# EAGLE design MySens-GWeasySensRS485-V01-014 (EAGLE 7.6.0)
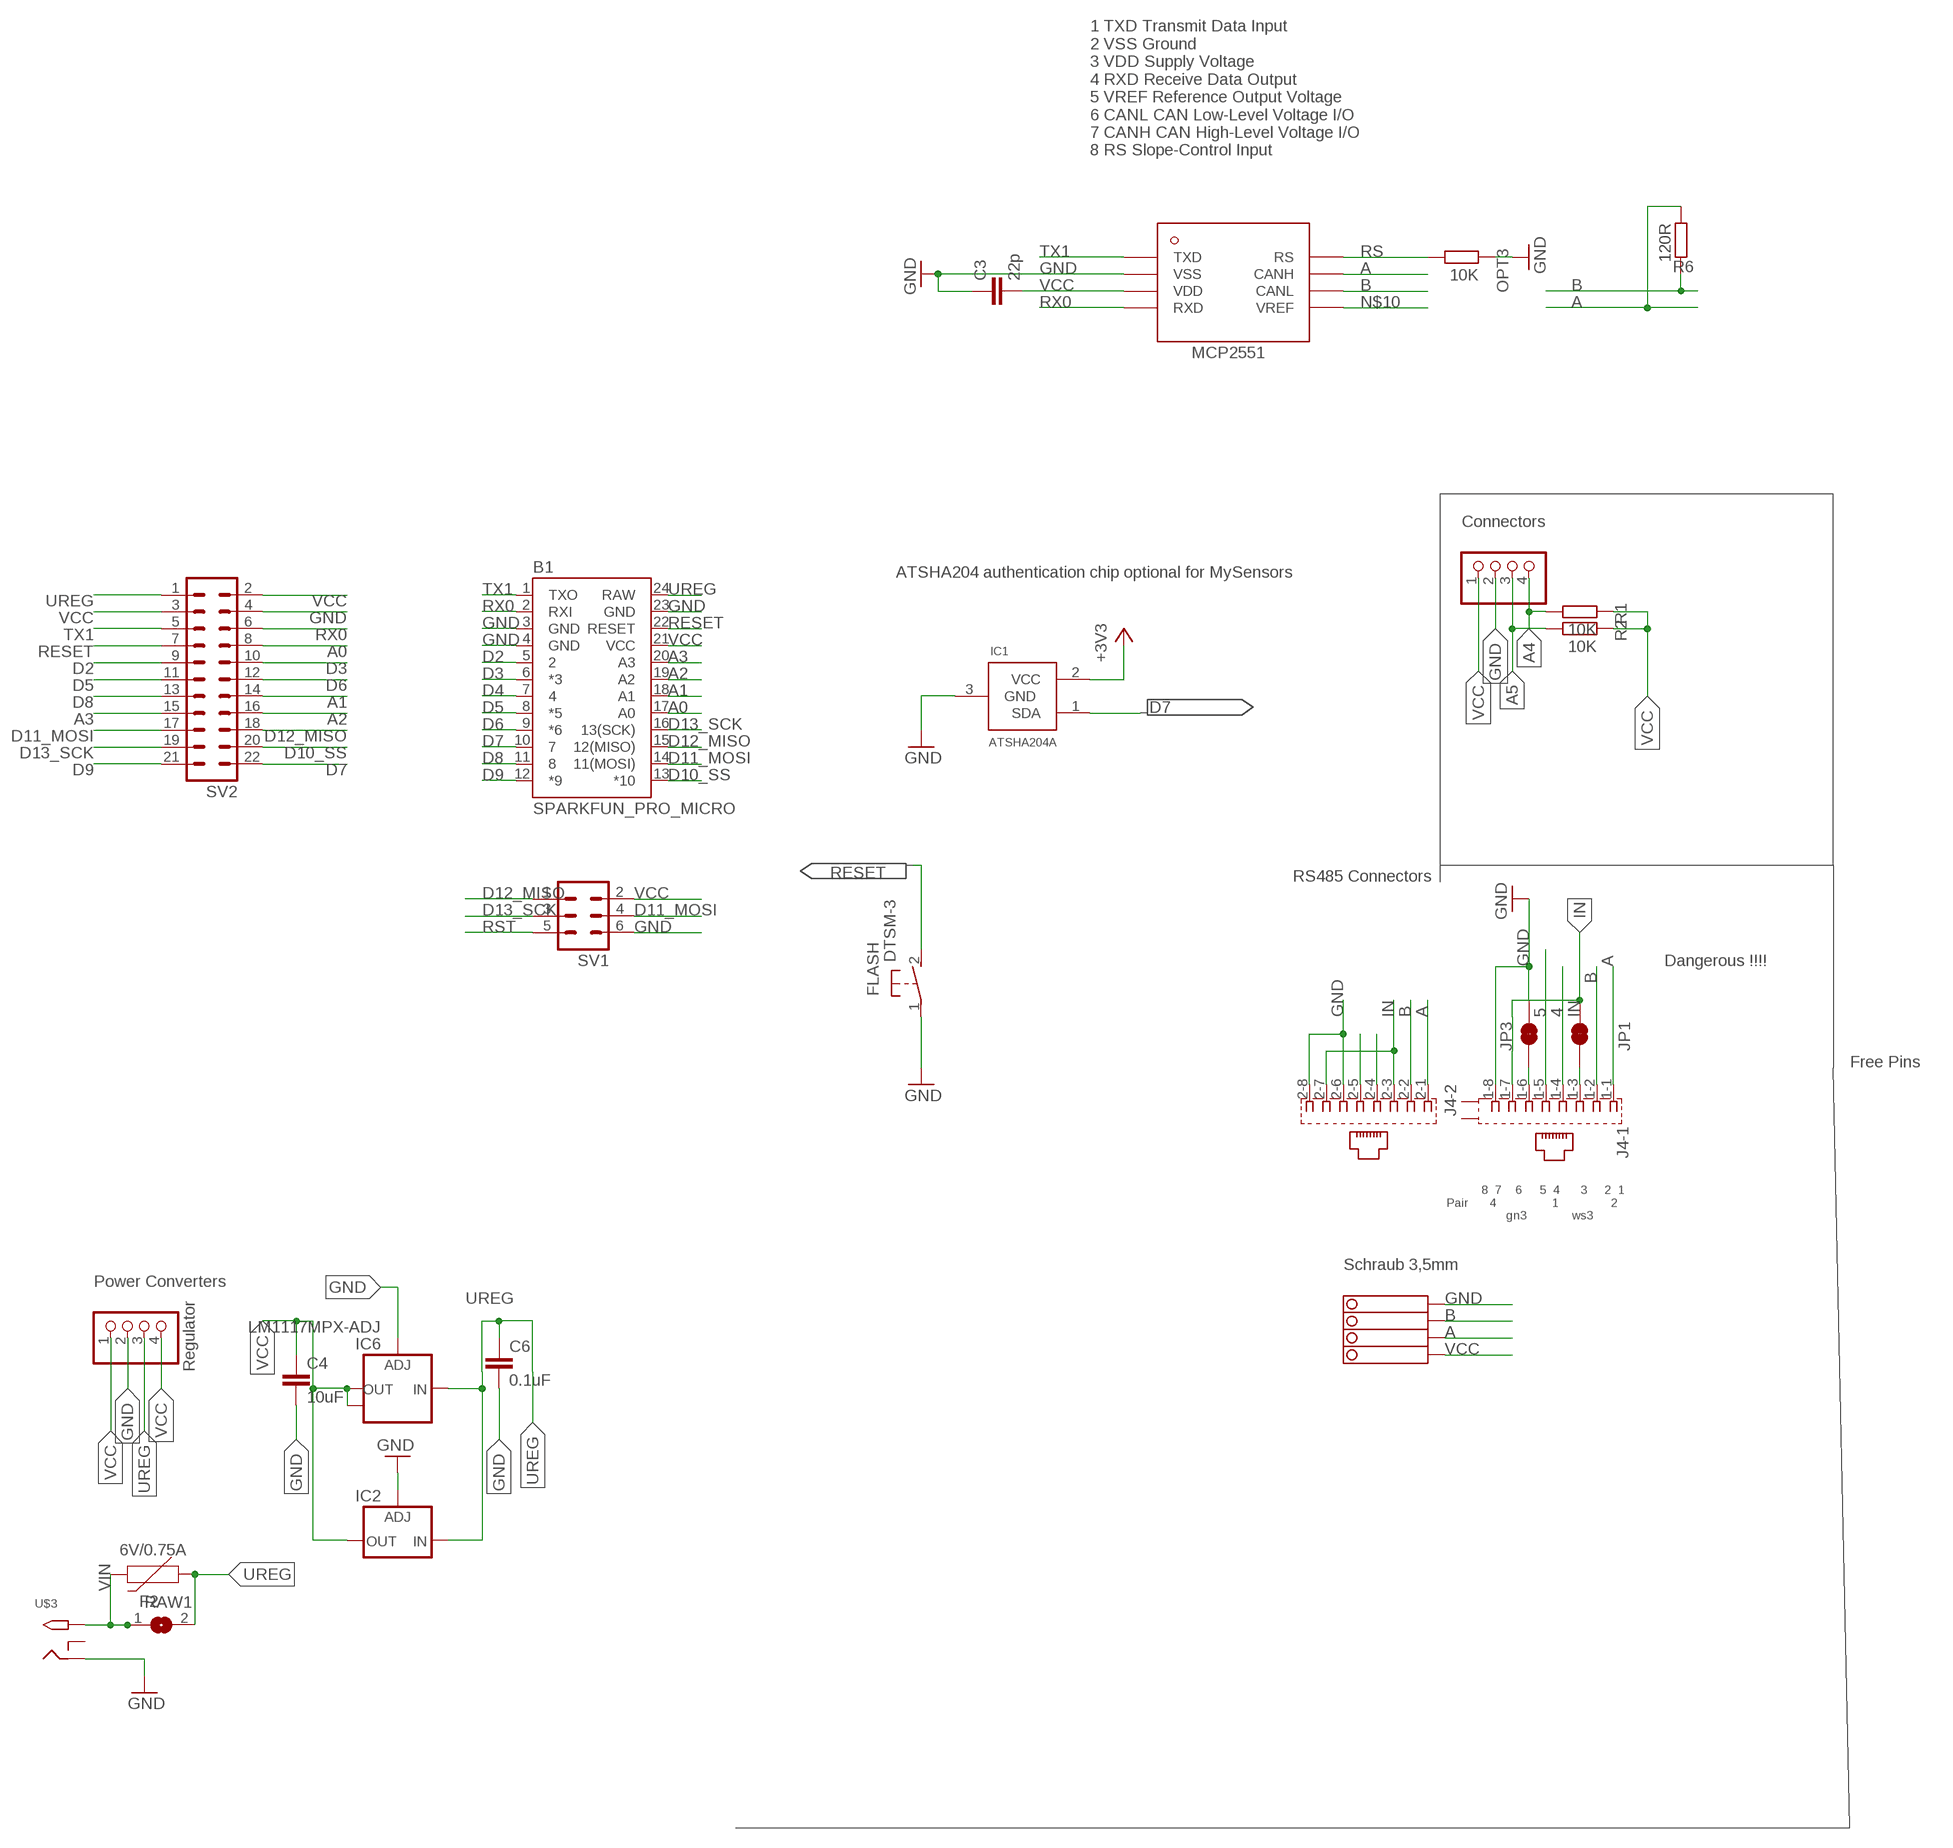
[diagram p0: schematic, sheet 1]

## Parts
B1  SPARKFUN_PRO_MICRO  [SPARKFUN_PRO_MICRO]
C3  22p  C-EUC0805  [C0805]
C4  10uF  C-EUC1210  [C1210]
C6  0.1uF  C-EUC1206  [C1206]
F2  6V/0.75A  PPTC_THREE-QUARTER-AMP  [1206]
FLASH  DTSM-3  [DTSM-3]
IC1  ATSHA204A  [SOT23]
IC2  LD117ADT50TR  [DPACK]
IC6  LM1117MPX-ADJ  [SOT223]
J4  RJ45_2X_NARROW_SHILDPINS_NOCASE  [RJ45_2X_NARROW_SHILDPINS_NOCASE]
JP1  JUMPER-SMT_2_NC_TRACE_SILK  [SMT-JUMPER_2_NC_TRACE_SILK]
JP3  JUMPER-SMT_2_NC_TRACE_SILK  [SMT-JUMPER_2_NC_TRACE_SILK]
JP10  PINHD-1X04_2.54-S  [1X04-S]
OPT3  10K  R-EU_R0805  [R0805]
R1  10K  R-EU_R0805  [R0805]
R2  10K  R-EU_R0805  [R0805]
R6  120R  R-EU_R0805  [R0805]
RAW1  SJ  [SJ]
STEPDWN  PINHD-1X04_2.54-S  [1X04-S]
SV1  MA03-2  [MA03-2]
SV2  MA11-2  [MA11-2]
U$1  MCP2551  [SOIC-8]
U$3  2.1MMJACKTHM  [PJ-102A]
X4  1751264  [1751264]

## Nets
1: J4.1-3 JP1.1
2: J4.1-6 JP3.1
3V3: IC1.2(VCC) ; supply symbol labelled +3V3
4: J4.1-4
5: J4.1-5
A: J4.1-1 J4.2-1 R6.1 U$1.CANH X4.2
A0: B1.17(A0) SV2.8
A1: B1.18(A1) SV2.14
A2: B1.19(A2) SV2.16
A3: B1.20(A3) SV2.15
A4: JP10.4 R1.2
A5: JP10.3 R2.2
B: J4.1-2 J4.2-2 R6.2 U$1.CANL X4.3
D2: B1.5 SV2.9
D3: B1.6(*3) SV2.10
D4: B1.7
D5: B1.8(*5) SV2.11
D6: B1.9(*6) SV2.12
D7: B1.10 IC1.1(SDA) SV2.22
D8: B1.11 SV2.13
D9: B1.12(*9) SV2.21
D10_SS: B1.13(*10) SV2.20
D11_MOSI: B1.14(11(MOSI)) SV1.4 SV2.17
D12_MISO: B1.15(12(MISO)) SV1.1 SV2.18
D13_SCK: B1.16(13(SCK)) SV1.3 SV2.19
GND [Power]: B1.3(GND) B1.4(GND) B1.23(GND) C3.1 C4.2 C6.2 FLASH.1 IC1.3(GND) IC2.1(ADJ) IC6.1(ADJ) J4.1-8 J4.2-6 J4.2-8 JP3.2 JP10.2 OPT3.1 STEPDWN.2 SV1.6 SV2.4 U$1.VSS U$3.RING X4.4
IN [Power]: J4.1-7 J4.2-3 J4.2-7 JP1.2
N$2: J4.2-4
N$3: J4.2-5
N$10: U$1.VREF
RESET: B1.22(RESET) FLASH.2 SV2.7
RS: OPT3.2 U$1.RS
RST: SV1.5
RX0: B1.2(RXI) SV2.6 U$1.RXD
TX1: B1.1(TXO) SV2.5 U$1.TXD
UREG [Power]: B1.24(RAW) C6.1 F2.1 IC2.3(IN) IC6.3(IN) RAW1.2 STEPDWN.3 SV2.1
VCC [Power]: B1.21(VCC) C3.2 C4.1 IC2.4(OUT) IC6.2(OUT) IC6.TAB(OUT1) JP10.1 R1.1 R2.1 STEPDWN.1 STEPDWN.4 SV1.2 SV2.2 SV2.3 U$1.VDD X4.1
VIN [Power]: F2.2 RAW1.1 U$3.TIP
Unconnected: J4.G1(-1:S1) J4.G3(-1:S2) U$3.RING_SW

## Notes on the sheet
- 1 TXD Transmit Data Input 
  2 VSS Ground 
  3 VDD Supply Voltage 
  4 RXD Receive Data Output 
  5 VREF Reference Output Voltage 
  6 CANL CAN Low-Level Voltage I/O 
  7 CANH CAN High-Level Voltage I/O 
  8 RS Slope-Control Input
- Connectors
- ATSHA204 authentication chip optional for MySensors
- RS485 Connectors
- Dangerous !!!!
- Free Pins
- 8  7    6     5  4      3     2  1
  Pair      4                1               2
                   gn3             ws3
- Schraub 3,5mm
- Power Converters
- Regulator

## Library data of the parts
B1 = SparkFun-Boards:SPARKFUN_PRO_MICRO: SparkFun Pro Micro Atmega32U4 compatible footprint. SparkFun Products: 3.3V/8MHz <https://www.sparkfun.com/products/12587> 5V/16MHz <https://www.sparkfun.com/products/12640>
C3 C4 C6 = rcl:C-EU: CAPACITOR, European symbol
F2 = SparkFun-Fuses:PPTC: Resettable Fuse PPTC Resettable Fuse. Really a sort of resistor with a polymeric positive temperature coefficient whose resistance increases dramatically with an increase in temperature. When heated by the power passing through the resistance rises causing the current to be limited, protecting the circuit. This is achieved by the transition of the polymer from a crystalline to an amorphous state where the conductive carbon separates breaking the conductive pathways found in the cool crystalline structure. When a PPTC cools back down it resumes conducting letting the circuit turn back on. SparkFun Products: SparkFun RedBoard - Programmed with Arduino <https://www.sparkfun.com/products/12757> Pro Micro - 5V/16MHz <https://www.sparkfun.com/products/12640> Arduino Pro 328 - 5V/16MHz <https://www.sparkfun.com/products/10915> MP3 Trigger <https://www.sparkfun.com/products/13720>; PROD_ID: RES-11150
FLASH = mechanics:DTSM-3: Diptronics SMD button 6x3.5 mm
IC1 = Sensor:ATSHA204A
IC2 = v-reg:LD117A?*: Low drop fixed and adjustable positive voltage regulators 1 A Source: http://www.st.com/stonline/products/literature/ds/7194/ld1117axx.pdf
IC6 = lm1117:LM1117MPX-ADJ
J4 = RJ45:RJ45_2X_NARROW_SHILDPINS_NOCASE: RJ45 connector
JP1 JP3 = SparkFun-Jumpers:JUMPER-SMT_2_NC_TRACE: Normally closed trace jumper This jumper has a trace between two pads so it's normally closed (NC). Use a razor knife to open the connection. For best results follow the IPC guidelines for cutting traces: Cutout at least 0.063 mm (0.005 in). Remove all loose material to clean up the cut area. Seal the cut with an approved epoxy. Reapply solder to reclose the connection.
JP10 STEPDWN = pinhead-2:PINHD-1X04: PIN HEADER
OPT3 R1 R2 R6 = rcl:R-EU_: RESISTOR, European symbol
RAW1 = jumper:SJ: SMD solder JUMPER
SV1 = con-lstb:MA03-2: PIN HEADER; OC_FARNELL: unknown; OC_NEWARK: unknown
SV2 = con-Pinheader:MA11-2: PIN HEADER; OC_FARNELL: unknown; OC_NEWARK: unknown
U$1 = MCP2551:MCP2551: The MCP2551 is a high-speed CAN, fault-tolerant device that serves as the interface between a CAN protocol controller and the physical bus. The MCP2551 provides differential transmit and receive capability for the CAN protocol controller and is fully compatible with the ISO-11898 standard, including 24V requirements. It will operate at speeds of up to 1 Mb/s. Typically, each node in a CAN system must have a device to convert the digital signals generated by a CAN controller to signals suitable for transmission over the bus cabling (differential output). It also provides a buffer between the CAN controller and the high-voltage spikes that can be generated on the CAN bus by outside sources (EMI, ESD, electrical transients, etc.).
U$3 = adafruit:2.1MMJACK: 2.1mm x 5.5mm THM DC jack with internal switch. Digikey part #PJ-102A, 4UCON part #05537 2.1mm x 5.5mm SMT DC jack with internal switch. Digikey part #PJ-002A-SMT, 4UCON part #03267 By microbuilder.eu & adafruit.com
X4 = con-phoenix-350:1751264: MKDS 1/ 4-3,5 Printklemme Nennstrom: 10 A Bemessungsspannung: 160 V Raster: 3,5 mm Polzahl: 4 Montageart: Löten Anschlussart: Schraubanschluss Anschlussrichtung vom Leiter zur Platine: 0° Source: http://eshop.phoenixcontact.com .. 1751264.pdf; MPN: 1751264; OC_FARNELL: unknown; OC_NEWARK: 10R0934

## Net classes
0 default: width 0.254 mm
1 Power: width 0.508 mm

## Board
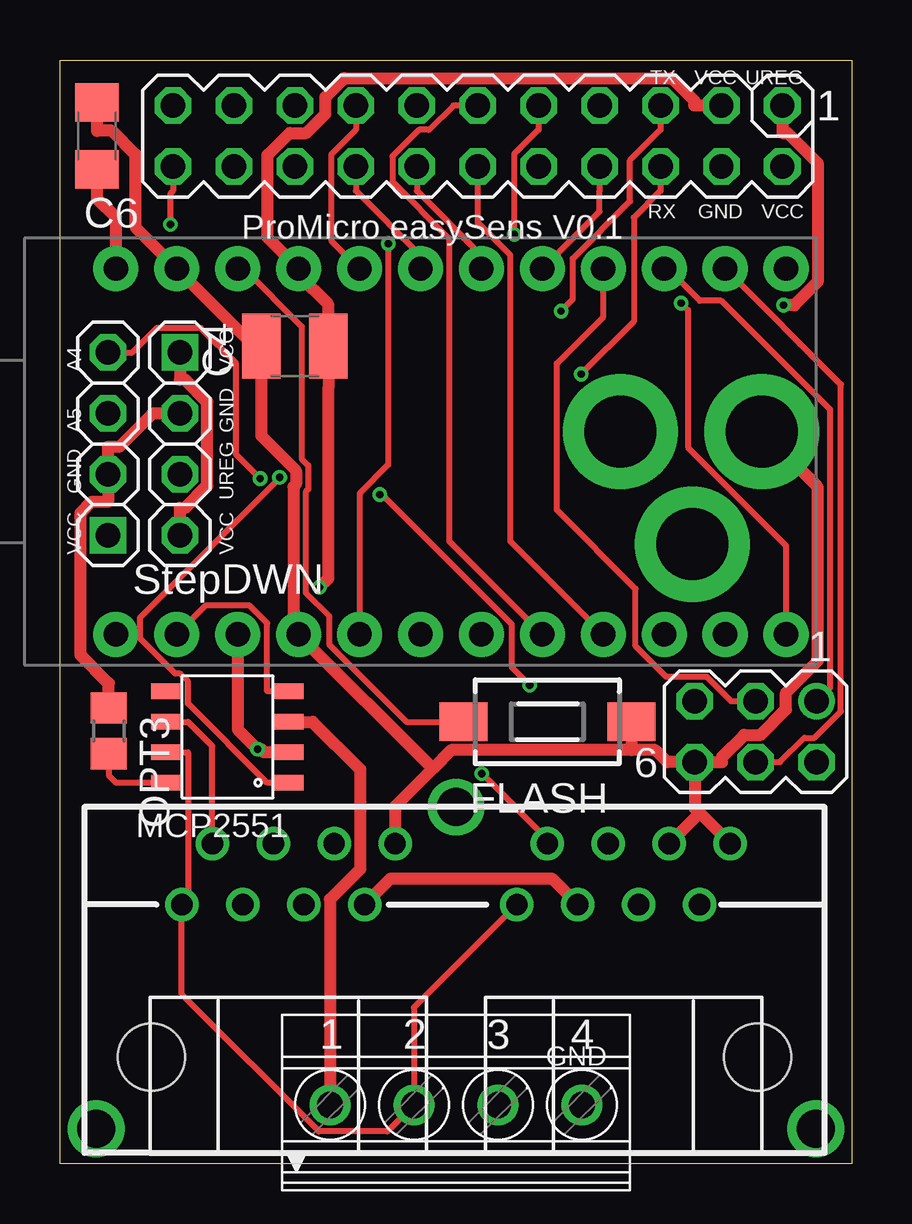
[diagram p1: board, top side]
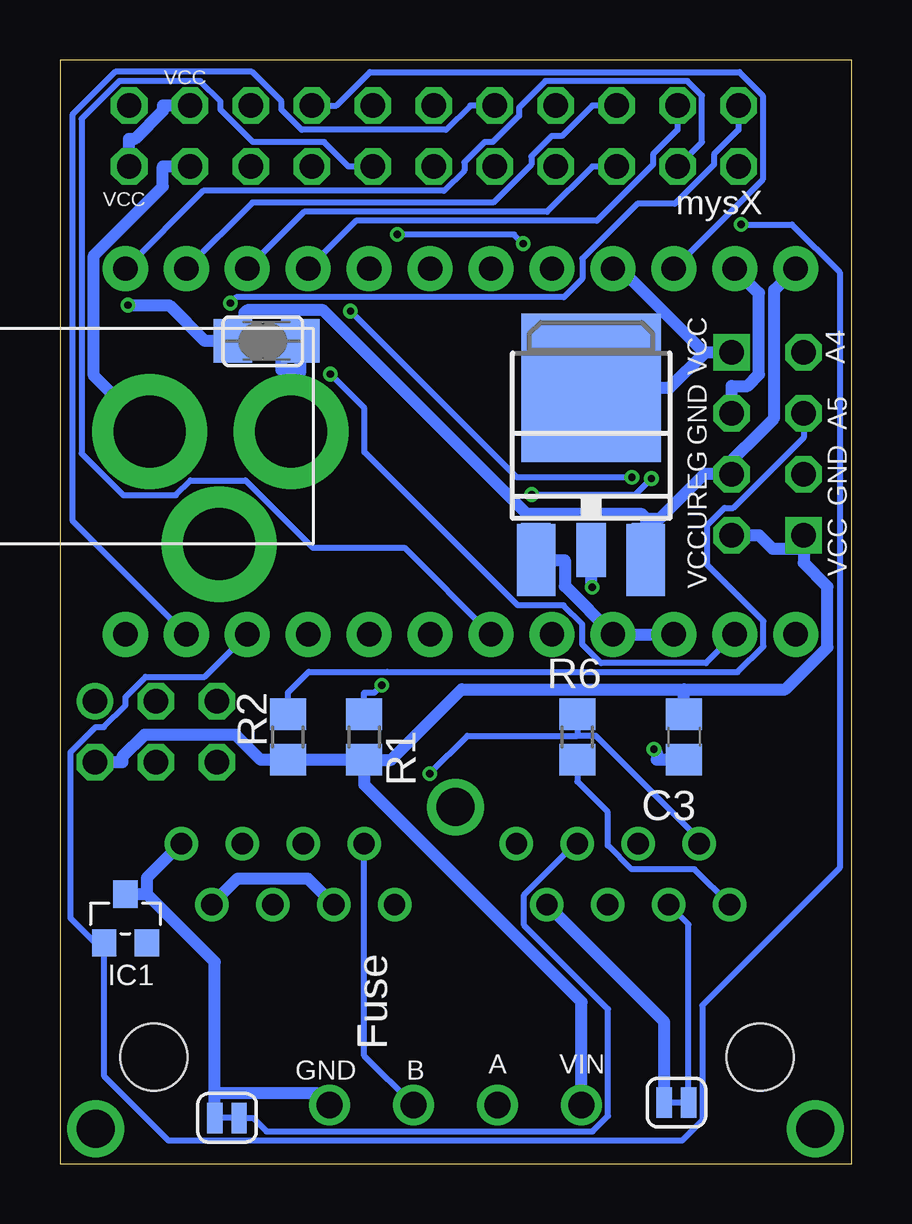
[diagram p2: board, bottom side, seen from below]

Size 33 x 46 mm. Coordinates in mm from the lower left corner, seen from the top.
Outline: 0,0 0,46 33,46 33,0 0,0
Copper layers (1*16): Top 0.035mm / dielectric 1.5mm / Bottom 0.035mm
Design rules "dirt_cheap_dirty_boards.v1": minimum track width 5mil, minimum drill 12mil, track to track 5mil, track to pad 5mil, pad to pad 5mil, via to via 5mil, smd to smd 0mil, copper to edge 10mil, drill to drill 10mil, minimum pad ring 10mil, minimum via ring 6mil, stop-mask expansion 2mil, vias tented up to drill 25mil, thermal gap 10mil

### Footprints (pad centres in the part's own frame; a part is rotated, then mirrored left to right if it is on the bottom)
SPARKFUN_PRO_MICRO = drill 1.016 pad 1.88: 1 -7.62,12.7; 2 -7.62,10.16; 3 -7.62,7.62; 4 -7.62,5.08; 5 -7.62,2.54; 6 -7.62,0; 7 -7.62,-2.54; 8 -7.62,-5.08; 9 -7.62,-7.62; 10 -7.62,-10.16; 11 -7.62,-12.7; 12 -7.62,-15.24; 13 7.62,-15.24; 14 7.62,-12.7; 15 7.62,-10.16; 16 7.62,-7.62; 17 7.62,-5.08; 18 7.62,-2.54; 19 7.62,0; 20 7.62,2.54; 21 7.62,5.08; 22 7.62,7.62; 23 7.62,10.16; 24 7.62,12.7
C0805 = smd 1.3 x 1.5: 1 -0.95,0; 2 0.95,0
C1210 = smd 1.6 x 2.7: 1 -1.4,0; 2 1.4,0
C1206 = smd 1.6 x 1.8: 1 -1.4,0; 2 1.4,0
1206 = smd 1.6 x 1.8: 1 -1.4,0; 2 1.4,0
DTSM-3 = smd 2 x 1.6: 1 -3.494,0; 2 3.494,0
SOT23 = smd 1.016 x 1.143: 1 -0.889,-1.016; 2 0.889,-1.016; 3 0,1.016
DPACK = smd 1.6 x 3: 1 -2.28,-4.8; 3 2.28,-4.8 | smd 5.8 x 6.2: 4 0,2.38
SOT223 = smd 1.219 x 2.235: 1 -2.311,-3.099; 2 0,-3.099; 3 2.311,-3.099 | smd 3.6 x 2.2: TAB 0,3.099
RJ45_2X_NARROW_SHILDPINS_NOCASE = drill 0.889: 1-1 -11.43,6.35; 1-2 -10.16,8.89; 1-3 -8.89,6.35; 1-4 -7.62,8.89; 1-5 -6.35,6.35; 1-6 -5.08,8.89; 1-7 -3.81,6.35; 1-8 -2.54,8.89; 2-1 2.54,6.35; 2-2 3.81,8.89; 2-3 5.08,6.35; 2-4 6.35,8.89; 2-5 7.62,6.35; 2-6 8.89,8.89; 2-7 10.16,6.35; 2-8 11.43,8.89 | drill 1.575 pad 2.184: G1 -15,-3; G2 0,10.414; G3 15,-3 | hole 2.8: -12.7,0; 12.573,0
SMT-JUMPER_2_NC_TRACE_SILK = smd 0.635 x 1.27: 1 -0.508,0; 2 0.508,0
1X04-S = drill 1.016 square: 1 -3.81,0 | drill 1.016 octagon: 2 -1.27,0; 3 1.27,0; 4 3.81,0
R0805 = smd 1.3 x 1.5: 1 -0.95,0; 2 0.95,0
SJ = smd 1.168 x 1.6: 1 -0.762,0; 2 0.762,0
MA03-2 = drill 1.016: 1 -2.54,-1.27 | drill 1.016 octagon: 2 -2.54,1.27; 3 0,-1.27; 4 0,1.27; 5 2.54,-1.27; 6 2.54,1.27
MA11-2 = drill 1.016 octagon: 1 -12.7,-1.27; 2 -12.7,1.27; 3 -10.16,-1.27; 4 -10.16,1.27; 5 -7.62,-1.27; 6 -7.62,1.27; 7 -5.08,-1.27; 8 -5.08,1.27; 9 -2.54,-1.27; 10 -2.54,1.27; 11 0,-1.27; 12 0,1.27; 13 2.54,-1.27; 14 2.54,1.27; 15 5.08,-1.27; 16 5.08,1.27; 17 7.62,-1.27; 18 7.62,1.27; 19 10.16,-1.27; 20 10.16,1.27; 21 12.7,-1.27; 22 12.7,1.27
SOIC-8 = smd 1.27 x 0.635: CANH 2.54,0.635; CANL 2.54,-0.635; RS 2.54,1.905; RXD -2.54,-1.905; TXD -2.54,1.905; VDD -2.54,-0.635; VREF 2.54,-1.905; VSS -2.54,0.635
PJ-102A = drill 3 pad 4.8: RING 0.1,-3.39; RING_SW -4.6,-6.29; TIP 0.1,-9.29
1751264 = drill 1.1 pad 1.7: 1 -5.25,-0.1; 2 -1.75,-0.1; 3 1.75,-0.1; 4 5.25,-0.1

### Placement (x,y rotation side)
B1  15.03,29.68 90 top
C3  6.99,17.78 90 bottom
C4  9.79,34.07 180 top
C6  1.54,42.83 90 top
F2  24.38,34.29 0 bottom
FLASH  20.32,18.41 180 top
IC1  30.27,10.21 0 bottom
IC2  10.86,29.96 0 bottom
IC6  10.86,28.67 0 bottom
J4  16.51,4.45 0 top
JP1  7.3,2.54 180 bottom
JP3  26.04,1.91 180 bottom
JP10  2,30 90 top
OPT3  2.03,18.03 270 top
R1  20.32,17.78 90 bottom
R2  23.5,17.78 90 bottom
R6  11.43,17.78 90 bottom
RAW1  24.54,34.27 180 bottom
STEPDWN  5,30 270 top
SV1  29,18 180 top
SV2  17.41,42.83 180 top
U$1  6.99,17.78 180 top
U$3  32.66,30.42 90 bottom
X4  16.51,2.54 0 top

### Tracks (layer width: path | path; a pad name or v marks a point on that pad's centre or on a via)
1
  Bottom 0.254: JP1.1 6.79,9.97 J4.1-3
2
  Bottom 0.254: JP3.1 24.95,1.91 24.39,1.33 10.8,1.33 10.15,1.98 10.15,6.43 13.65,9.94 13.65,11.19 11.51,13.34 J4.1-6
A
  Top 0.254: U$1.CANH 5.33,17.14 5.33,11.05 J4.1-1 5.08,7.05 10.8,1.33 13.65,1.33 X4.2 14.76,6.5 J4.2-1
  Bottom 0.254: R6.1 11.43,15.93 10.16,14.66 10.16,13.26 9.17,12.26 6.55,12.26 J4.1-1
A0
  Top 0.254: B1.17 22.5,39.69 22.5,40.54 SV2.8
A1
  Top 0.254: SV2.14 14.88,40.54 17.57,37.85 B1.18
A2
  Top 0.254: SV2.16 12.34,40.54 15.03,37.85 B1.19
A3
  Top 0.254: SV2.15 12.34,43.08 11.31,42.06 11.31,38.48 B1.20
A4  (via drill 0.3 pad 0.61)
  Top 0.254: JP10.4 3.02,33.81 4.03,34.83 5.87,34.83 7.34,33.36 7.34,29.55 v8.34,28.55 | v19.58,19.94 18.84,20.68 18.84,22.48 13.44,27.88 v13.33,27.88 | v13.33,27.88
  Bottom 0.254: R1.2 20.32,19.63 19.89,19.63 v19.58,19.94 | v13.33,27.88 9.01,27.88 v8.34,28.55
A5
  Bottom 0.254: JP10.3 2,30.25 4.93,27.32 5.3,27.32 6.02,26.61 6.02,24.95 3.68,22.61 3.68,21.56 4.75,20.48 19.34,20.48 19.35,20.5 22.63,20.5 23.5,19.63 R2.2
B  (via drill 0.3 pad 0.61)
  Top 0.254: J4.2-2 20.32,13.52 v17.59,16.25 | U$1.CANL 5.33,18.41 6.35,17.4 J4.1-2
  Bottom 0.254: v17.59,16.25 16.01,17.83 11.43,17.83 | X4.3 20.32,4.5 J4.2-2 | R6.2 11.43,17.83 | J4.1-2 6.35,13.51 10.66,17.83 11.43,17.83
D2  (via drill 0.3 pad 0.61)
  Top 0.254: v18.94,38.73 18.94,42.07 19.95,43.08 SV2.9 | v13.68,38.34 13.68,29.13 12.49,27.93 B1.5
  Bottom 0.254: v13.68,38.34 14.07,38.73 v18.94,38.73
D3
  Bottom 0.254: B1.6 18.64,25.67 22.46,25.67 25.27,28.47 27.56,28.47 28.17,27.86 30.36,27.86 32.1,29.59 32.1,43.55 30.53,45.12 27.15,45.12 26.3,44.27 26.3,43.93 24.95,42.58 21.99,42.58 20.97,41.56 SV2.10
D5
  Top 0.254: SV2.11 16.4,44.1 15.38,43.08 14.96,43.08 13.86,41.98 13.86,40.92 16.23,38.56 16.23,25.94 B1.8
D6
  Top 0.254: B1.9 18.77,25.94 18.77,37.88 17.41,39.24 17.41,40.54 SV2.12
D7  (via drill 0.3 pad 0.61)
  Top 0.254: SV2.22 4.71,40.54 4.6,40.43 v4.6,39.14
  Bottom 0.254: v4.6,39.14 2.48,39.14 0.49,37.15 0.49,12.32 6.22,6.59 6.22,1.8 7.06,0.95 28.47,0.95 31.15,3.63 IC1.1 31.54,9.2 32.56,10.22 32.56,17.15 31.52,18.19 31.17,18.19 30.27,19.09 30.27,19.45 29.43,20.29 26.96,20.29 B1.10
D8
  Bottom 0.254: SV2.13 15.89,44.1 16.91,43.08 22.92,43.08 23.77,43.93 23.77,44.27 25,45.5 30.69,45.5 32.48,43.71 32.48,26.81 B1.11
D9  (via drill 0.3 pad 0.61)
  Top 0.254: v25.9,35.86 26.18,35.58 26.18,29.85 30.27,25.76 B1.12
  Bottom 0.254: v25.9,35.86 25.65,36.11 11.99,36.11 11.22,36.88 11.22,37.72 8.93,40.01 7.37,40.01 5.73,41.65 5.73,42.07 4.71,43.08 SV2.21
D10_SS
  Bottom 0.254: SV2.20 6.24,42.58 6.24,44.52 6.83,45.12 12.76,45.12 13.86,44.02 13.86,43.68 14.96,42.58 15.3,42.58 16.14,41.73 16.14,41.39 16.99,40.54 27.03,40.54 B1.13
D11_MOSI
  Top 0.254: SV1.4 30.02,16.73 31.03,17.75 31.45,17.75 32.56,18.85 32.56,32.47 B1.14
  Bottom 0.254: B1.14 24.98,40.05 14.94,40.05 13.35,41.64 13.35,41.98 12.51,42.83 12.08,42.83 10.81,44.1 SV2.17
D12_MISO
  Top 0.254: SV1.1 32.11,19.84 32.11,31.43 27.57,35.97 26.68,35.97 25.34,37.3 B1.15
  Bottom 0.254: B1.15 22.82,39.67 12.7,39.67 10.81,41.56 SV2.18
D13_SCK
  Top 0.254: SV1.3 27.98,19.27 26.97,20.29 25.28,20.29 24,21.57 24,23.95 20.71,27.24 20.71,33.35 22.65,35.29 B1.16
  Bottom 0.254: B1.16 20.66,39.29 10.62,39.29 8.27,41.64 8.27,42.07 7.25,43.08 SV2.19
GND  (via drill 0.3 pad 0.61)
  Top 0.508: 15.54,16.47 13.97,14.89 J4.1-8 | 15.54,16.47 B1.4 9.74,22.27 9.74,28.21 9.84,28.32 9.84,28.89 8.39,30.34 8.39,32.34 C4.2 8.1,34.07 B1.23 3.16,39.01 3.16,42.06 2.17,43.05 1.54,43.05 C6.2 | 23.81,17.23 16.31,17.23 15.54,16.47 | 23.81,17.23 24.81,17.23 25.32,16.73 SV1.6 | STEPDWN.2 3.86,31.27 2.46,29.87 2,29.87 JP10.2 2,27.59 1.33,27.59 0.86,27.12 0.86,21.19 2.03,20.02 OPT3.1 | SV1.6 27.6,16.73 27.6,16.95 28.52,17.87 29.22,17.87 30.27,18.92 30.27,19.62 31.59,20.94 31.59,28.19 U$3.RING | FLASH.1 23.81,17.23 | B1.3 7.41,18.1 v8.24,17.27 8.39,17.27 8.51,17.14 U$1.VSS | 26.67,14.61 J4.2-8 | SV1.6 26.46,14.81 26.67,14.61 | 26.67,14.61 J4.2-6
  Bottom 0.508: 26.54,2.92 26.54,8.4 29.38,11.23 | X4.4 22.24,2.92 26.54,2.92 | B1.3 B1.4 11.96,24.07 11.96,25.16 IC2.1 13.14,25.54 IC6.1 | C3.1 8.12,16.83 8.12,17.14 v8.24,17.27 | IC1.3 29.38,11.23 | J4.2-8 29.38,11.9 29.38,11.23 | STEPDWN.2 5,32.41 4.33,32.41 3.86,32.89 3.86,36.29 B1.23 | SV2.4 28.72,41.56 28.72,40.73 31.59,37.85 31.59,32.84 U$3.RING | JP3.2 26.54,2.92
IN
  Top 0.508: J4.1-7 13.78,11.88 20.51,11.88 J4.2-3
  Bottom 0.508: JP1.2 7.81,5.9 J4.1-7 | J4.2-7 25.58,11.88 22.68,11.88 J4.2-3
RESET
  Top 0.254: B1.22 7.67,37.3 10.08,34.89 10.08,29.37 10.35,29.09 10.35,28.11 10.25,28 10.25,23.79 11.22,22.82 11.22,21.64 14.45,18.41 FLASH.2
  Bottom 0.254: SV2.7 21.48,44.1 20.08,45.5 4.68,45.5 3.7,44.52 3.7,41.01 B1.22
RS
  Top 0.254: OPT3.2 2.03,16.18 2.34,15.88 U$1.RS
RX0  (via drill 0.3 pad 0.61)
  Top 0.254: v21.73,32.91 23.92,35.1 23.92,39.43 25.04,40.54 SV2.6 | U$1.RXD 8.64,19.68 8.64,22.52 7.91,23.25 6.06,23.25 B1.2
  Bottom 0.254: B1.2 6.07,20.86 10.44,20.86 11.22,21.64 11.22,22.48 12,23.26 13.91,23.26 20.3,29.66 20.3,31.48 v21.73,32.91
TX1  (via drill 0.3 pad 0.61)
  Top 0.254: 3.34,22.06 3.34,22.76 9.16,28.57 v9.16,28.6 | v20.89,35.53 21.38,36.02 21.38,37.72 23.77,40.1 23.77,41.81 25.04,43.08 SV2.5 | 3.34,22.06 3.34,21.9 4.81,20.43 5.01,20.43 5.33,20.11 5.33,19.18 8.64,15.88 U$1.TXD | 3.34,22.06 B1.1
  Bottom 0.254: v9.16,28.6 13.96,28.6 v20.89,35.53
UREG  (via drill 0.3 pad 0.61)
  Top 0.508: SV2.1 30.11,42.96 30.34,42.96 31.59,41.7 31.59,36.75 30.62,35.78 v30.16,35.78 | C6.1 1.54,40.25 2.33,39.46 B1.24
  Bottom 0.508: 5.57,28.73 3.22,31.08 3.22,36.41 B1.24 | 5.57,28.73 6.14,28.73 7.99,26.88 8.55,26.88 | STEPDWN.3 5.57,28.73 | 8.55,26.88 8.73,27.07 13.52,27.07 22.02,35.57 25.19,35.57 25.3,35.45 RAW1.2 25.32,34.29 F2.1 26.96,34.29 28.46,35.78 v30.16,35.78 | 8.55,26.88 8.55,26.83 IC6.3 8.58,25.54 IC2.3
VCC  (via drill 0.3 pad 0.61)
  Top 0.508: SV2.3 26.43,44.1 26.43,44.32 25.51,45.25 11.86,45.25 11.06,44.45 11.06,43.75 10.27,42.96 9.57,42.96 8.65,42.04 8.65,38.6 B1.21 9.95,37.04 11.19,35.8 C4.1 11.19,32.34 11.19,24.4 v10.81,24.02 | X4.1 11.26,11.02 12.52,12.27 12.52,16.44 10.54,18.41 U$1.VDD | STEPDWN.1 5,32.67 5.22,32.67 6.14,31.75 6.14,28.25 5.22,27.33 5,27.33 STEPDWN.4
  Bottom 0.508: SV2.2 30.11,42.7 29.89,42.7 28.72,43.88 28.72,44.1 SV2.3 | STEPDWN.4 3.86,26.19 3.29,25.62 2,25.62 | 2,25.62 2,25.05 1,24.05 1,21.52 2.76,19.76 6.99,19.76 | JP10.1 2,25.62 | 6.99,19.76 16.26,19.76 19.19,16.83 R1.1 | X4.1 11.26,6.74 20.32,15.8 R1.1 | B1.21 9.63,37.3 6.14,33.81 | STEPDWN.1 6.14,33.81 | 6.14,33.81 6.14,33.77 7.58,32.34 IC2.4 10.29,31.77 IC6.TAB | SV1.2 30.4,16.73 30.4,16.95 29.48,17.87 25.67,17.87 24.63,16.83 R2.1 R1.1 | C3.2 6.99,19.76 | v10.81,24.02 10.86,24.07 IC6.2
VIN
  Bottom 0.508: RAW1.1 23.78,33.09 23.45,33.09 23.36,33.01 | 23.36,33.01 22.98,33.01 F2.2 | U$3.TIP 23.36,33.01

### Text on the board
tNames: TX | VCC | UREG | ProMicro easySens V0.1 | RX | GND | VCC | C6 | A4 | VCC | A5 | GND | GND | UREG | VCC | VCC | StepDWN | GND
bNames: VCC | mysX | VCC | VCC | A4 | GND | A5 | GND | UREG | VCC | VCC | Fuse | VIN | A | B | GND